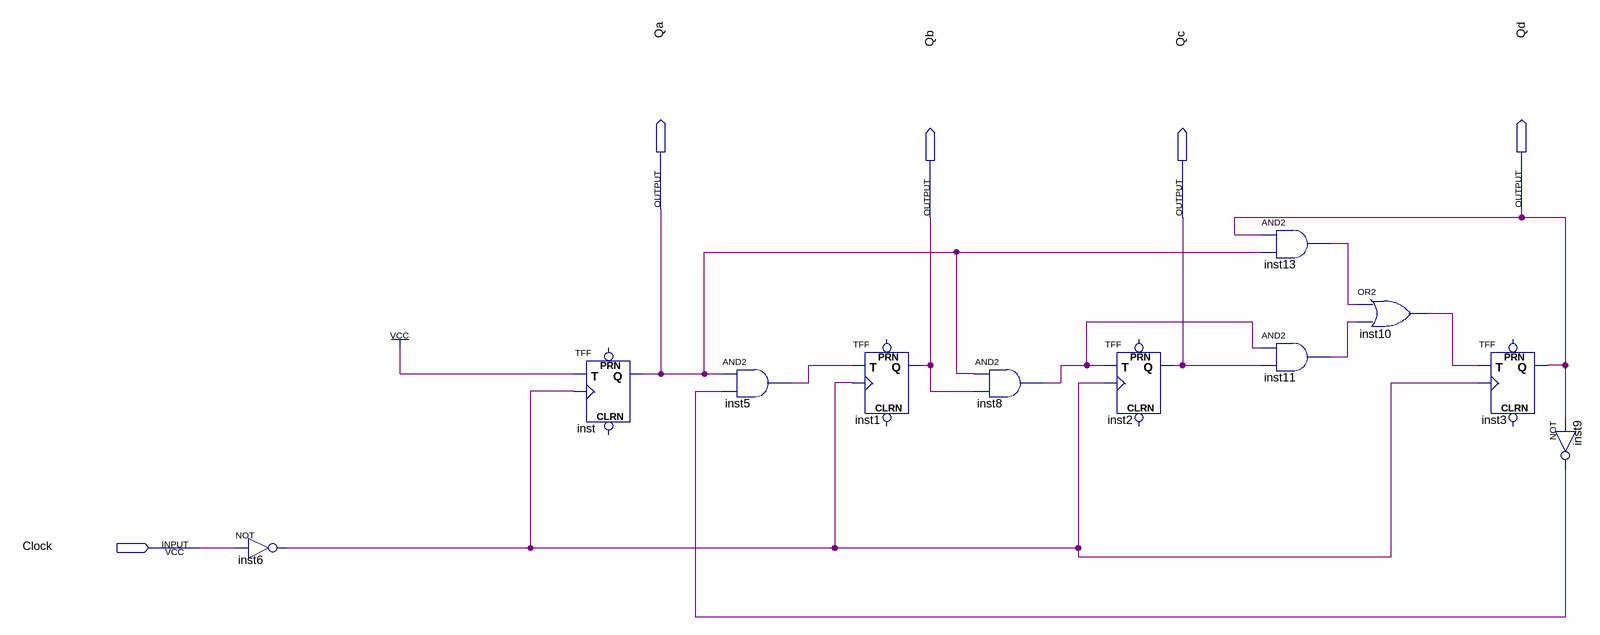
[diagram p0: schematic sheet]
// Quartus schematic ContadorModulo10.bdf as structural Verilog: 11 symbols, 5 pins
module ContadorModulo10 (
  input  Clock,
  output Qa,
  output Qd,
  output Qb,
  output Qc
);

  wire inst5_out, inst6_out, inst8_out, inst9_out, inst10_out, inst11_out, inst13_out;

  not inst6 (inst6_out, Clock);
  TFF inst (.T(1'b1), .CLK(inst6_out), .Q(Qa));  // open: PRN, CLRN
  and inst5 (inst5_out, Qa, inst9_out);
  TFF inst1 (.T(inst5_out), .CLK(inst6_out), .Q(Qb));  // open: PRN, CLRN
  and inst8 (inst8_out, Qa, Qb);
  TFF inst2 (.T(inst8_out), .CLK(inst6_out), .Q(Qc));  // open: PRN, CLRN
  and inst13 (inst13_out, Qd, Qa);
  and inst11 (inst11_out, inst8_out, Qc);
  or inst10 (inst10_out, inst13_out, inst11_out);
  TFF inst3 (.T(inst10_out), .CLK(inst6_out), .Q(Qd));  // open: PRN, CLRN
  not inst9 (inst9_out, Qd);
endmodule
